# Altium schematic sheet Repeated_Schematic.SchDoc
size A4; SheetNumber: 1; SheetTotal: 2
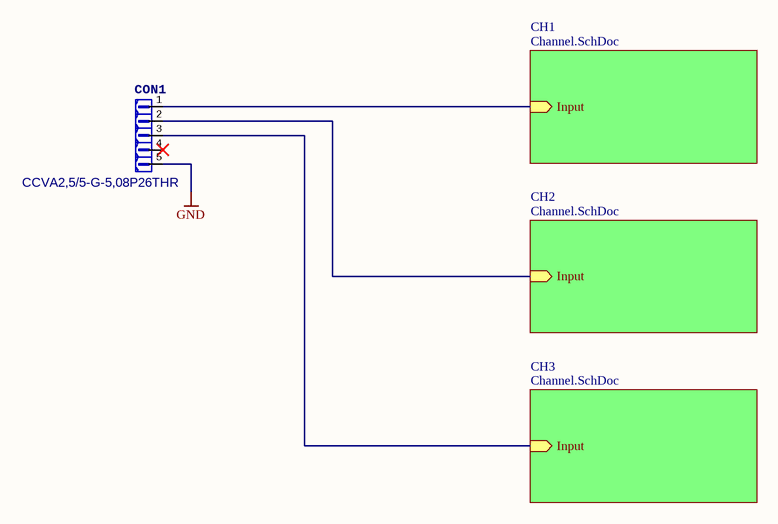
[diagram p0: Repeated_Schematic.SchDoc]

## Parts
CON1  CCVA2,5/5-G-5,08P26THR  [CCVA2,5/5-G-5,08P26THR]

## Sub-sheets
CH1 = Channel.SchDoc: Input (in)
CH2 = Channel.SchDoc: Input (in)
CH3 = Channel.SchDoc: Input (in)

## Nets
GND: CON1.5
NetCON1_1: CON1.1 ; sheet CH1/Input
NetCON1_2: CON1.2 ; sheet CH2/Input
NetCON1_3: CON1.3 ; sheet CH3/Input

Not connected (* = marked no-connect by the designer): CON1 4*

## Library data of the parts
CON1 = CCVA2,5/5-G-5,08P26THR: CCVA2,5/5-G-5,08P26THR 7polig 5.08mm Raster; BE-NR: BE-30-00271